# Altium schematic sheet LoopFilterWaveyRadar.SchDoc: Loop Filter WaveyRadar Schematic
size Letter; Author: Will Vu; CompanyName: Raccoon Wireless; DrawnBy: Will Vu, Raccoon Wireless; Engineer: Will Vu; Organization: Raccoon Wireless; DocumentNumber: 2-04; Revision: 2; SheetNumber: 4; SheetTotal: 15
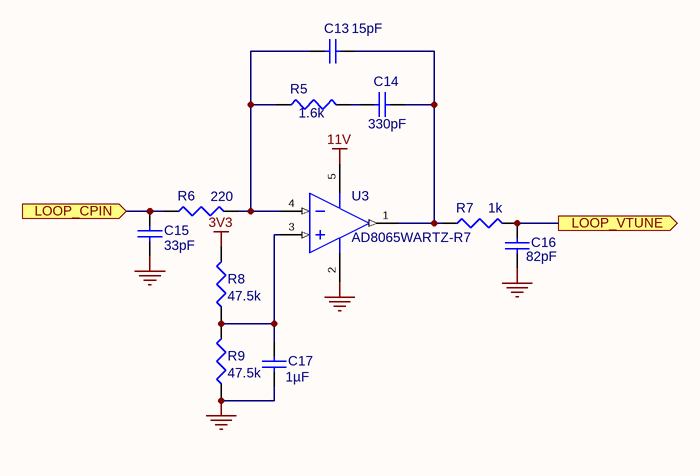
[diagram p0: LoopFilterWaveyRadar.SchDoc]

## Parts
C13  value 15pF  [CAPC1005X56X25LL10T15]  (hidden comment: 04025A150JAT2A)
C14  value 330pF  [FP-GRM155-0_05-MFG]  (hidden comment: GRM1555C1H331JA01D)
C15  value 33pF  [CAPC1005X56X25LL10T15]  (hidden comment: 04025A330JAT2A)
C16  value 82pF  [CAPC1005X56X25LL10T15]  (hidden comment: 04025A820FAT2A)
C17  value 1µF  [CAPC0402(1005)60_L]  (hidden comment: Capacitor 1µF +/-20% 10V 0402)
R5  value 1.6k  [RESC0402(1005)_L]  (hidden comment: Resistor 1K6 +/-5 % 0402 63 mW)
R6  value 220  [RESC1005X40X25NL05T05]  (hidden comment: ERJ-2RKF2200X)
R7  value 1k  [RESC1005X40X25ML05T05]  (hidden comment: Resistor 1k +/-1% 0402 100 mW)
R8  value 47.5k  [RESC0402(1005)_L]  (hidden comment: Resistor 47K5 +/-1 % 0402 63 mW)
R9  value 47.5k  [RESC0402(1005)_L]  (hidden comment: Resistor 47K5 +/-1 % 0402 63 mW)
U3  AD8065WARTZ-R7  [ADI-RJ-5_N]

## Ports
LOOP_CPIN (in), LOOP_VTUNE (out)

## Nets
3V3: R8.2
11V: U3.5(+VS)
GND: C15.1 C16.2 C17.2 R9.1 U3.2(-VS)
LOOP_CPIN: C15.2 R6.1 ; port LOOP_CPIN
LOOP_VTUNE: C16.1 R7.2 ; port LOOP_VTUNE
NetC13_1: C13.1 R5.1 R6.2 U3.4(-IN)
NetC13_2: C13.2 C14.2 R7.1 U3.1(VOUT)
NetC14_1: C14.1 R5.2
NetC17_1: C17.1 R8.1 R9.2 U3.3(+IN)

## Notes on the sheet
- /

## Library data of the parts
C13 = CMP-001-00087-1: Cap Ceramic 15pF 50V C0G 5% SMD 0402 125C T/R
C14 = CMP-001-00086-1: MURATA - GRM1555C1H331JA01D - CERAMIC CAPACITOR 330PF 50V, C0G, 5%, 0402
C15 = CMP-001-00084-1: AVX - 04025A330JAT2A - Ceramiczny kondensator wielowarstw. SMD, 33 pF, 50 V, 0402 [jedn. metryczne: 1005], ± 5%, C0G / NP0
C16 = CMP-001-00088-1: Multilayer Ceramic Capacitors MLCC - SMD/SMT 50V 82pF C0G 0402 1% Tol
C17 = CMP-001-00063-4: Chip Capacitor, 1µF +/-20%, 10V, 0402, Thickness 0.6 mm; Tolerance: 10%; Max Operating Temperature: 85°C; Mounting Technology: SMT; Pins: 2; Min Operating Temperature: -55°C; Voltage Rating: 10V; Case/Package: 0402
R5 = CMP-009-00160-4: Chip Resistor, 1,6 kOhms, +/-5 %, 63 mW, -55 to 155 degC, 0402; Power: 63mW; Tolerance: 5%; Pins: 2; Min Operating Temperature: -55°C; Max Operating Temperature: 155°C; Case/Package: 0402
R6 = CMP-009-00184-1: PANASONIC ELECTRONIC COMPONENTS - ERJ2RKF2200X - RES, THICK FILM, 220R, 1%, 0.1W, 0402
R7 = CMP-009-00009-8: Chip Resistor, 1 KOhm, +/- 1%, 0.1 W, -55 to 155 degC, 0402 (1005 Metric); Voltage Rating: 50V; Power: 100mW; Mounting Technology: SM; Case/Package: 0402; Max Operating Temperature: 155°C; RoHS Compliant: True; Min Operating Temperature: -55°C; Tolerance: 1%; Pins: 2
R8 R9 = CMP-009-00137-4: Chip Resistor, 47,5 kOhms, +/-1 %, 63 mW, -55 to 155 degC, 0402; Tolerance: 1%; Power: 63mW; Min Operating Temperature: -55°C; Case/Package: 0402; Max Operating Temperature: 155°C; Pins: 2
U3 = CMP-014-00002-3: Op Amp Single High Performance Amplifier R-R O/P ±5V/10V Automotive 5-Pin SOT-23 T/R